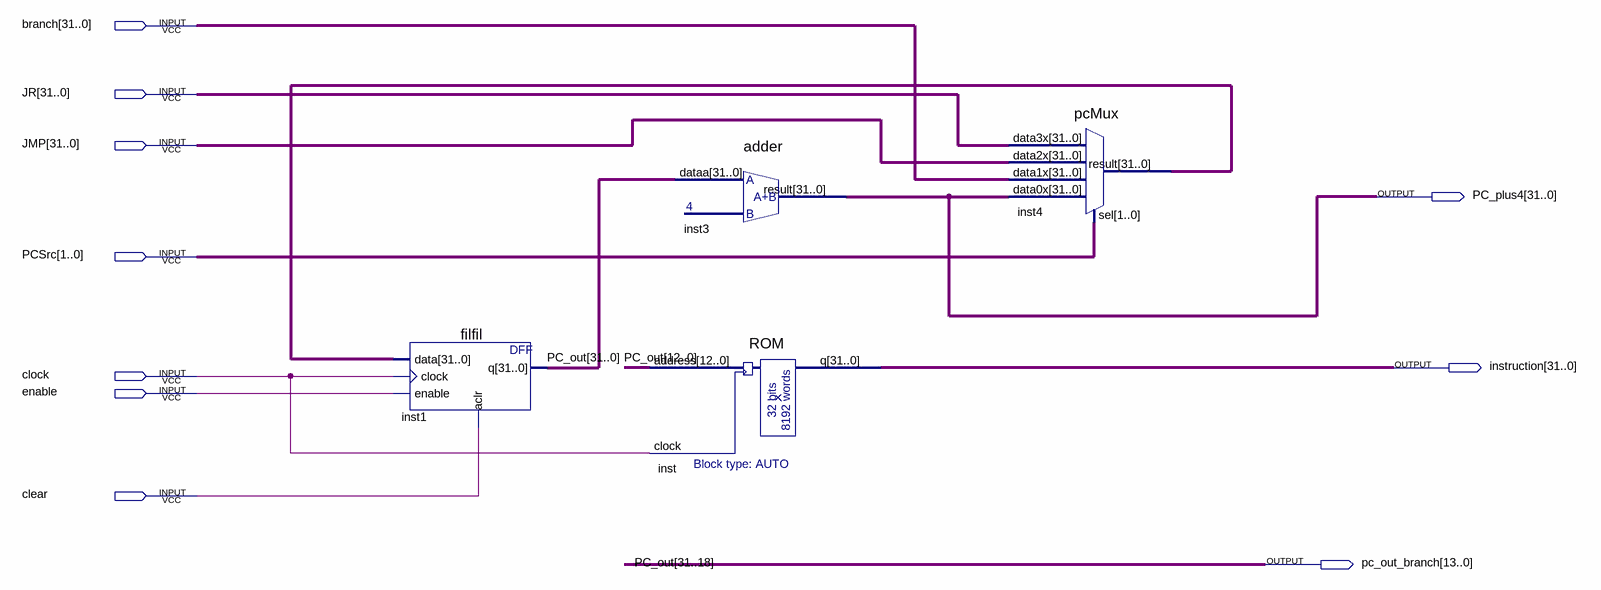
[diagram p0: schematic sheet]
// Quartus schematic instFetchLEVEL.bdf as structural Verilog: 4 symbols, 10 pins
module instFetchLEVEL (
  input  [31:0] branch,
  input  [31:0] JR,
  input  [31:0] JMP,
  input  [1:0] PCSrc,
  input  clock,
  input  enable,
  input  clear,
  output [31:0] PC_plus4,
  output [31:0] instruction,
  output [13:0] pc_out_branch
);

  wire [17:0] PC_out;
  wire [31:0] inst4_result;

  filfil inst1 (.data(inst4_result), .clock(clock), .enable(enable), .aclr(clear), .q({pc_out_branch, PC_out}));
  ROM inst (.address(PC_out[12:0]), .clock(clock), .q(instruction));
  adder inst3 (.dataa({pc_out_branch, PC_out}), .result(PC_plus4));
  pcMux inst4 (.data3x(JR), .data2x(JMP), .data1x(branch), .data0x(PC_plus4), .sel(PCSrc), .result(inst4_result));

  // Other names for the same wires on the sheet: PC_out[31:18] = pc_out_branch
endmodule
